# Altium project Pleiades_P01.PrjPcb (part 10 of 10)
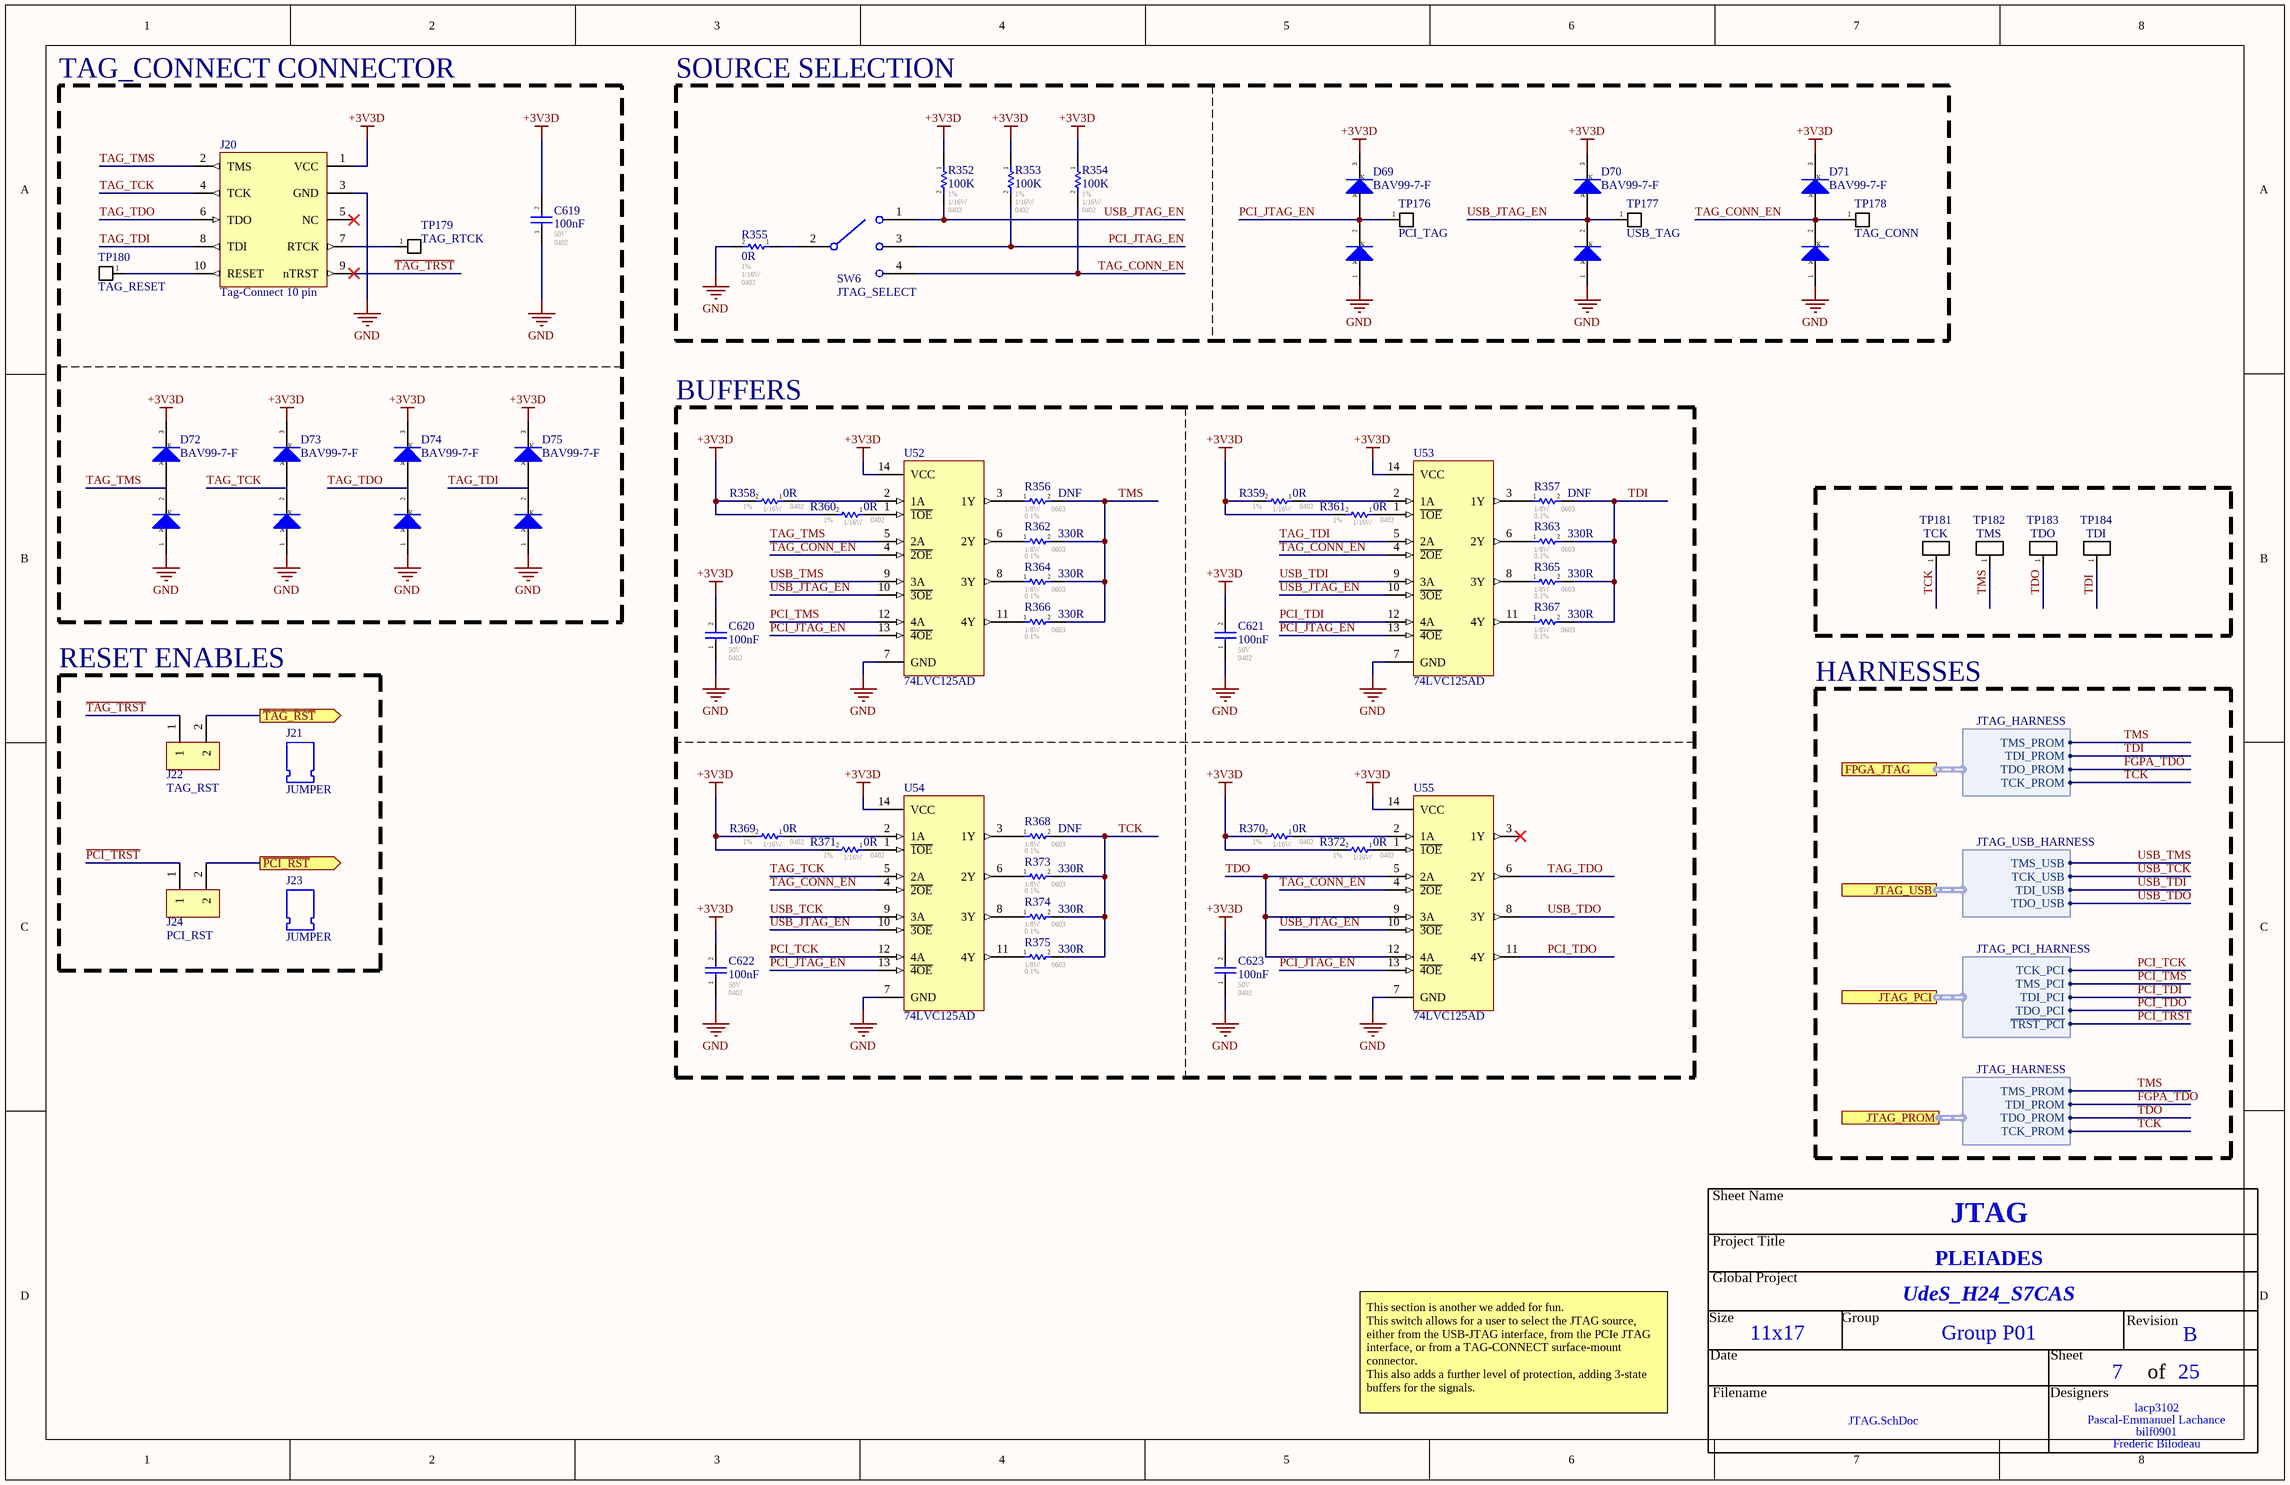
[diagram p65: JTAG.SchDoc]

## Nets that join several sheets
+1V2D: POWER_FPGA (9 pins), POWER_SENSING (Q7.1 R333.1 U40.17), FPGA_MISC (31 pins)
+1V8D: POWER_FPGA (8 pins), POWER_SENSING (Q6.1 R328.1 U40.21), PROM (10 pins), ADC (16 pins), DAC (18 pins), FPGA_MISC (5 pins), FPGA_IO (10 pins), SENSORS (5 pins)
+2V5D: POWER_DDR3 (16 pins), POWER_SENSING (R329.1 R330.1)
+3V3A: POWER_ANALOG (8 pins), ADC (12 pins), DAC (19 pins)
+3V3D: POWER_FPGA (13 pins), POWER_DDR3 (R222.1), POWER_MOTORS (C479.1 U32.1 U32.7), POWER_SENSING (11 pins), PROM (17 pins), FPGA_MISC (59 pins), FPGA_IO (42 pins), MOTOR_CONTROL (5 pins), USER_IO (36 pins), CLOCK (32 pins), USB (C487.1 C488.1 FB5.1), ETHERNET (6 pins), PCI (21 pins), SENSORS (18 pins), JTAG (28 pins)
+5V: POWER_INPUT (5 pins), MOTOR_CONTROL (C363.1 C367.1 U18.3 U18.4)
+5V0A: POWER_ANALOG (8 pins), ADC (18 pins), DAC (5 pins)
+5V_MOT: POWER_MOTORS (12 pins), MOTOR_CONTROL (18 pins)
+6V: POWER_ANALOG (15 pins), POWER_SENSING (R319.1 R320.1)
+12V: POWER_INPUT (10 pins), POWER_FPGA (C465.1 C466.1 R244.1 U29.1), POWER_DDR3 (C434.1 C435.1 U26.1), POWER_ANALOG (8 pins), POWER_SENSING (R315.1 R316.1 R326.1 R331.1), FPGA_MISC (C105.1 J2.2)
+24V_IN: POWER_INPUT (9 pins), POWER_MOTORS (R272.1 U36.1)
+24V_MOT: POWER_MOTORS (13 pins), MOTOR_CONTROL (8 pins)
+VDDR: DDR3 (83 pins), POWER_DDR3 (12 pins), POWER_SENSING (R321.1), FPGA_MISC (C143.1 C144.1 C145.1 C146.1), FPGA_IO (6 pins)
+VREF_DDR: POWER_DDR3 (C430.1 C431.1 TP87.1 U27.6), FPGA_IO (C149.1 U4.C3 U4.L8)
+VTT: DDR3 (59 pins), POWER_DDR3 (8 pins), POWER_SENSING (R322.1)
-5V0A: POWER_ANALOG (9 pins), ADC (18 pins), DAC (5 pins)
-6V: POWER_ANALOG (12 pins), POWER_SENSING (R318.2)
GND: MECHANICAL (19 pins), DDR3 (116 pins), POWER_INPUT (14 pins), POWER_FPGA (34 pins), POWER_DDR3 (51 pins), POWER_ANALOG (87 pins), POWER_MOTORS (C479.2 U32.2 U32.8), POWER_SENSING (39 pins), PROM (28 pins), ADC (80 pins), DAC (70 pins), FPGA_MISC (132 pins), FPGA_IO (5 pins), MOTOR_CONTROL (10 pins), USER_IO (47 pins), CLOCK (56 pins), USB (23 pins), ETHERNET (35 pins), PCI (44 pins), SENSORS (22 pins), JTAG (18 pins)
GND_IN: POWER_INPUT (9 pins), POWER_MOTORS (C486.1 R276.2 SW4.2 U36.3)
GND_MOT: POWER_MOTORS (23 pins), MOTOR_CONTROL (46 pins)
+1V2D_SHUNT_+: POWER_FPGA (NT51.2), POWER_SENSING (U41.12)
+1V2D_SHUNT_-: POWER_FPGA (NT50.2), POWER_SENSING (U41.13)
+1V8D_SHUNT_+: POWER_FPGA (NT49.2), POWER_SENSING (U41.10)
+1V8D_SHUNT_-: POWER_FPGA (NT48.2), POWER_SENSING (U41.9)
+2V5D_SHUNT_+: POWER_DDR3 (NT45.2), POWER_SENSING (U41.3)
+2V5D_SHUNT_-: POWER_DDR3 (NT44.2), POWER_SENSING (U41.2)
+3V3A_EN: POWER_ANALOG (R190.2), FPGA_IO (U4.A20)
+3V3D_SHUNT_+: POWER_FPGA (NT47.2), POWER_SENSING (U41.5)
+3V3D_SHUNT_-: POWER_FPGA (NT46.2), POWER_SENSING (U41.6)
+5V0A_EN: POWER_ANALOG (R189.2), FPGA_IO (U4.A21)
+6V_EN: POWER_ANALOG (R187.2 R197.1), FPGA_IO (U4.C21)
+6V_SHUNT_+: POWER_ANALOG (NT41.2), POWER_SENSING (U39.5)
+6V_SHUNT_-: POWER_ANALOG (NT40.2), POWER_SENSING (U39.6)
+12V_SHUNT_+: POWER_INPUT (NT39.2), POWER_SENSING (U39.3)
+12V_SHUNT_-: POWER_INPUT (NT38.2), POWER_SENSING (U39.2)
-5V0A_EN: POWER_ANALOG (R217.2 R219.1), FPGA_IO (U4.B22)
-6V_EN: POWER_ANALOG (R214.2 R215.1), FPGA_IO (U4.T20)
-6V_SHUNT_+: POWER_ANALOG (NT43.2), POWER_SENSING (U39.9)
-6V_SHUNT_-: POWER_ANALOG (NT42.2), POWER_SENSING (U39.10)
~{CAS}: DDR3 (NT8.2 U1.K3), FPGA_IO (U4.K6)
~{CE}: PROM (U6.B4), FPGA_IO (R63.2 U4.AF23)
~{CEO}: PROM (U6.D2), FPGA_IO (U4.AF18)
~{CF}: PROM (U6.D1), FPGA_IO (U4.AA17)
~{CS}: DAC (TP65.1 U11.33), FPGA_IO (U4.R3)
~{DDR_CS}: DDR3 (NT4.2 U1.L2), FPGA_IO (U4.K8)
~{DDR_RESET}: DDR3 (NT18.2 U1.T2), FPGA_IO (U4.B2)
~{ENABLE_ISO}: FPGA_IO (U4.V8), MOTOR_CONTROL (U13.3)
~{HOME_ISO}: FPGA_IO (U4.U9), MOTOR_CONTROL (ISO1.4)
~{IMU_CS}: FPGA_IO (U4.M6), SENSORS (TP170.1 U48.22)
~{IRQ}: DAC (U11.34), FPGA_IO (U4.N7)
~{PCI_RST}: FPGA_IO (R67.2), JTAG (J24.2)
~{PCI_TRST}: PCI (U44.14), JTAG (J24.1)
~{PERST_PCI}: FPGA_IO (U4.G8), PCI (TP142.1 U44.12)
~{PLL_SYNC}: FPGA_IO (U4.H17), CLOCK (TP15.1 U5.14)
~{PRSNT_PCI}: FPGA_IO (U4.F7), PCI (TP143.1 U44.11)
~{RAS}: DDR3 (NT6.2 U1.J3), FPGA_IO (U4.K7)
~{RESET_ISO}: FPGA_IO (U4.V10), MOTOR_CONTROL (U13.2)
~{RST_DAC}: DAC (R132.2 TP64.1 U11.36), FPGA_IO (U4.P7)
~{SENSE_CS}: POWER_SENSING (R312.2 U40.31), FPGA_IO (U4.B6)
~{SLEEP_ISO}: FPGA_IO (U4.T10), MOTOR_CONTROL (U17.3)
~{TAG_RST}: FPGA_IO (R68.2), JTAG (J22.2)
~{WAKE_PCI}: FPGA_IO (U4.C7), PCI (TP141.1 U44.13)
~{WDT_EN}: FPGA_MISC (R57.2 U3.3), FPGA_IO (U4.A25)
~{WE}: DDR3 (NT10.2 U1.L3), FPGA_IO (U4.E4)
ADC_CTRL1: ADC (TP44.1 U9.35), FPGA_IO (U4.T6)
ADC_CTRL2: ADC (TP45.1 U9.36), FPGA_IO (U4.T8)
ADC_CTRL3: ADC (TP46.1 U9.37), FPGA_IO (U4.M10)
ADC_SCLK: ADC (TP40.1 U9.13), FPGA_IO (U4.N8)
AUXIN: FPGA_IO (U4.W19), MOTOR_CONTROL (U18.9)
BTN_1: FPGA_IO (U4.Y15), USER_IO (6 pins)
BTN_2: FPGA_IO (U4.Y14), USER_IO (6 pins)
BUSY: PROM (R79.1 U6.C1), FPGA_IO (U4.Y16)
CK_N: DDR3 (NT27.2 U1.K7), FPGA_IO (U4.G3)
CK_P: DDR3 (NT24.2 U1.J7), FPGA_IO (U4.G4)
CKE: DDR3 (NT2.2 U1.K9), FPGA_IO (U4.F5)
CLK: PROM (U6.B3), FPGA_IO (R62.2 R64.1 U4.AD22)
CLK_ADC_400MHZ_N: ADC (C236.1 R94.1), CLOCK (U5.17)
CLK_ADC_400MHZ_P: ADC (C235.1 R95.1), CLOCK (U5.16)
CLK_ADC_OUT_N: ADC (TP39.1 U9.56), FPGA_IO (U4.A13)
CLK_ADC_OUT_P: ADC (TP37.1 U9.57), FPGA_IO (U4.C13)
CLK_DAC_200MHZ_N: DAC (R128.1 U11.4), CLOCK (U5.20)
CLK_DAC_200MHZ_P: DAC (R129.1 U11.3), CLOCK (U5.19)
CLK_FPGA_100MHZ_N: FPGA_IO (U4.B14), CLOCK (TP22.1 U5.28)
CLK_FPGA_100MHZ_P: FPGA_IO (U4.A14), CLOCK (TP21.1 U5.27)
CLKOUT: PROM (U6.C2), FPGA_IO (U4.AD18)
COL_CONFIG0: FPGA_IO (U4.R24), ETHERNET (U37.28)
CRS_CONFIG1: FPGA_IO (U4.N20), ETHERNET (U37.29)
D0_N: DAC (R151.1 U11.28), FPGA_IO (U4.F11)
D0_P: DAC (R148.1 U11.27), FPGA_IO (U4.D11)
D1_N: DAC (R144.1 U11.26), FPGA_IO (U4.E9)
D1_P: DAC (R141.1 U11.25), FPGA_IO (U4.F9)
D2_N: DAC (R138.1 U11.24), FPGA_IO (U4.A11)
D2_P: DAC (R135.1 U11.23), FPGA_IO (U4.C11)
D3_N: DAC (R150.1 U11.22), FPGA_IO (U4.C10)
D3_P: DAC (R147.1 U11.21), FPGA_IO (U4.D10)
D4_N: DAC (R143.1 U11.16), FPGA_IO (U4.C8)
D4_P: DAC (R140.1 U11.15), FPGA_IO (U4.D8)
D5_N: DAC (R137.1 U11.14), FPGA_IO (U4.A8)
D5_P: DAC (R134.1 U11.13), FPGA_IO (U4.B8)
D6_N: DAC (R149.1 U11.12), FPGA_IO (U4.A9)
D6_P: DAC (R146.1 U11.11), FPGA_IO (U4.C9)
D7_N: DAC (R142.1 U11.10), FPGA_IO (U4.A10)
D7_P: DAC (R139.1 U11.9), FPGA_IO (U4.B10)
DA0_N: ADC (U9.40), FPGA_IO (U4.C14)
DA0_P: ADC (U9.41), FPGA_IO (U4.D14)
DA2_N: ADC (U9.42), FPGA_IO (U4.A15)
DA2_P: ADC (U9.43), FPGA_IO (U4.C15)
DA4_N: ADC (U9.44), FPGA_IO (U4.A16)
DA4_P: ADC (U9.45), FPGA_IO (U4.B16)
DA6_N: ADC (U9.46), FPGA_IO (U4.G14)
DA6_P: ADC (U9.47), FPGA_IO (U4.J14)
DA8_N: ADC (U9.50), FPGA_IO (U4.H15)
DA8_P: ADC (U9.51), FPGA_IO (U4.J15)
DA10_N: ADC (U9.52), FPGA_IO (U4.C16)
DA10_P: ADC (U9.53), FPGA_IO (U4.D16)
DA12_N: ADC (U9.54), FPGA_IO (U4.F15)
DA12_P: ADC (U9.55), FPGA_IO (U4.G16)
DAC_SCLK: DAC (TP62.1 U11.32), FPGA_IO (U4.P6)
DB0_N: ADC (U9.60), FPGA_IO (U4.E16)
DB0_P: ADC (U9.61), FPGA_IO (U4.F16)
DB2_N: ADC (U9.62), FPGA_IO (U4.A17)
DB2_P: ADC (U9.63), FPGA_IO (U4.C17)
DB4_N: ADC (U9.2), FPGA_IO (U4.D19)
DB4_P: ADC (U9.3), FPGA_IO (U4.E19)
DB6_N: ADC (U9.4), FPGA_IO (U4.D20)
DB6_P: ADC (U9.5), FPGA_IO (U4.E20)
DB8_N: ADC (U9.6), FPGA_IO (U4.C20)
DB8_P: ADC (U9.7), FPGA_IO (U4.D21)
DB10_N: ADC (U9.8), FPGA_IO (U4.C18)
DB10_P: ADC (U9.9), FPGA_IO (U4.D18)
DB12_N: ADC (U9.10), FPGA_IO (U4.E17)
DB12_P: ADC (U9.11), FPGA_IO (U4.F17)
DCI_N: DAC (R136.1 U11.18), FPGA_IO (U4.D7)
DCI_P: DAC (R133.1 U11.17), FPGA_IO (U4.E8)
DDR_PWR_EN: POWER_DDR3 (R231.2), FPGA_IO (U4.AE26)
DDR_SW_EN: POWER_DDR3 (R223.2 R227.1), FPGA_IO (U4.AA25)
DDR_VTT_EN: POWER_DDR3 (R225.1), FPGA_IO (U4.AE25)
DEBUG_LED_1: FPGA_IO (U4.AF9), USER_IO (R172.1)
DEBUG_LED_2: FPGA_IO (U4.AD11), USER_IO (R173.1)
DEBUG_LED_3: FPGA_IO (U4.AE11), USER_IO (R183.1)
DEBUG_LED_4: FPGA_IO (U4.AF11), USER_IO (R184.1)
DIR_ISO: FPGA_IO (U4.U7), MOTOR_CONTROL (U16.2)
EN_EXT_SEL: PROM (R82.2 U6.H4), FPGA_IO (U4.AD19)
FAN_PWM: FPGA_MISC (D1.2 R54.1), FPGA_IO (U4.P18)
FAN_TACH: FPGA_MISC (D2.2 R55.1 R56.2), FPGA_IO (U4.R20)
FGPA_TDO: PROM (U6.G1), FPGA_IO (U4.A24)
FRAME_N: DAC (R131.1 U11.20), FPGA_IO (U4.C6)
FRAME_P: DAC (R130.1 U11.19), FPGA_IO (U4.D6)
HSI0_N: FPGA_IO (U4.D5), PCI (R334.2 U43.15)
HSI0_P: FPGA_IO (U4.E6), PCI (R334.1 U43.16)
HSO0_N: FPGA_IO (U4.A2), PCI (U43.13)
HSO0_P: FPGA_IO (U4.A3), PCI (U43.14)
IMU_FSYNC: FPGA_IO (U4.L7), SENSORS (TP171.1 U48.11)
IMU_INT: FPGA_IO (U4.L6), SENSORS (TP165.1 U48.12)
IMU_SCLK: FPGA_IO (U4.M8), SENSORS (TP167.1 U48.23)
IMU_SDI: FPGA_IO (U4.L4), SENSORS (TP168.1 U48.24)
IMU_SDO: FPGA_IO (U4.L3), SENSORS (TP169.1 U48.9)
IN0: FPGA_IO (U4.AF12), USER_IO (U19.3)
IN1: FPGA_IO (U4.AD12), USER_IO (U19.6)
IN2: FPGA_IO (U4.AD13), USER_IO (U19.8)
IN3: FPGA_IO (U4.AC13), USER_IO (U19.11)
INTRP: FPGA_IO (U4.M21), ETHERNET (R292.2 U37.21)
IO_IN_EN: FPGA_IO (U4.AA12), USER_IO (U19.1 U19.4 U19.10 U19.13)
IO_OUT_EN: FPGA_IO (U4.AC12), USER_IO (U20.1 U20.4 U20.10 U20.13)
LDM: DDR3 (NT16.2 U1.E7), FPGA_IO (U4.J3)
LDQS_N: DDR3 (U1.F3), FPGA_IO (U4.F1)
LDQS_P: DDR3 (U1.G3), FPGA_IO (U4.F3)
MDC: FPGA_IO (U4.R23), ETHERNET (U37.12)
MDIO: FPGA_IO (U4.AB24), ETHERNET (R291.2 U37.11)
MISO: ADC (TP43.1 U9.64), FPGA_IO (U4.R9)
MOSI: ADC (TP42.1 U9.14), FPGA_IO (U4.P8)
NetU4_T18: POWER_MOTORS (U32.4), FPGA_IO (U4.T18)
NetU4_T19: POWER_MOTORS (U32.5), FPGA_IO (U4.T19)
NetU4_U21: POWER_MOTORS (U32.6), FPGA_IO (U4.U21)
NetU4_U23: POWER_MOTORS (U32.3), FPGA_IO (U4.U23)
ODT: DDR3 (NT12.2 U1.K1), FPGA_IO (U4.H7)
OE/RESET: PROM (U6.A3), FPGA_IO (R65.2 U4.AE4)
OUT0: FPGA_IO (U4.AB13), USER_IO (U20.2)
OUT1: FPGA_IO (U4.AA13), USER_IO (U20.5)
OUT2: FPGA_IO (U4.Y13), USER_IO (U20.9)
OUT3: FPGA_IO (U4.W13), USER_IO (U20.12)
PCI_TCK: PCI (U42.14), JTAG (U54.12)
PCI_TDI: PCI (U42.12), JTAG (U53.12)
PCI_TDO: PCI (U42.11), JTAG (U55.11)
PCI_TMS: PCI (U42.13), JTAG (U52.12)
PLL_LOCK: FPGA_IO (U4.B20), CLOCK (TP20.1 U5.37)
PLL_SPI_CLK: FPGA_IO (U4.A18), CLOCK (TP17.1 U5.24)
PLL_SPI_LE: FPGA_IO (U4.B18), CLOCK (TP16.1 U5.25)
PLL_SPI_MISO: FPGA_IO (U4.A19), CLOCK (TP19.1 U5.22)
PLL_SPI_MOSI: FPGA_IO (U4.C19), CLOCK (TP18.1 U5.23)
PROGRAM_B: FPGA_IO (R66.2 R67.1 R68.1 U4.AF3), USB (R277.2 R285.1)
PROM_D0: PROM (U6.H6), FPGA_IO (U4.AD20)
PROM_D1: PROM (U6.H5), FPGA_IO (U4.AE17)
PROM_D2: PROM (U6.E5), FPGA_IO (U4.AF17)
PROM_D3: PROM (U6.D5), FPGA_IO (U4.AD10)
PROM_D4: PROM (U6.C5), FPGA_IO (U4.AF10)
PROM_D5: PROM (U6.B5), FPGA_IO (U4.AE7)
PROM_D6: PROM (U6.A5), FPGA_IO (U4.AF7)
PROM_D7: PROM (U6.A6), FPGA_IO (U4.AE9)
PROM_TCK: PROM (U6.H3), FPGA_IO (U4.E21), JTAG (5 pins)
PROM_TDO: PROM (U6.E6), JTAG (TP183.1 U55.5 U55.9 U55.12)
PROM_TMS: PROM (U6.E2), FPGA_IO (U4.C23), JTAG (5 pins)
REF_CLK_N: DAC (TP67.1 U11.7), FPGA_IO (U4.R1)
REF_CLK_P: DAC (TP66.1 U11.6), FPGA_IO (U4.R2)
REFCLK_N: FPGA_IO (U4.A4), PCI (U45.13)
REFCLK_P: FPGA_IO (U4.B4), PCI (U45.14)
RESET: ADC (TP38.1 U9.12), FPGA_IO (U4.P10)
REV_SEL0: PROM (R80.1 U6.G3), FPGA_IO (U4.W17)
REV_SEL1: PROM (R81.1 U6.G4), FPGA_IO (U4.V16)
RFUSE: FPGA_MISC (J1.2 TP4.1), FPGA_IO (U4.AA20)
RST_ETH_PHY: FPGA_IO (U4.N19), ETHERNET (D46.2)
RTC_MFP: FPGA_MISC (R45.2 TP5.1 U2.7), FPGA_IO (U4.L24)
RTC_SCL: FPGA_MISC (R47.2 TP7.1 U2.6), FPGA_IO (U4.K19)
RTC_SDA: FPGA_MISC (R46.2 TP6.1 U2.5), FPGA_IO (U4.L19)
RXC: FPGA_IO (U4.W25), ETHERNET (R301.2)
RXD: FPGA_IO (U4.W18), MOTOR_CONTROL (U18.5)
RXD0: FPGA_IO (U4.V23), ETHERNET (R297.2)
RXD1: FPGA_IO (U4.W24), ETHERNET (R298.2)
RXD2: FPGA_IO (U4.U25), ETHERNET (R299.2)
RXD3: FPGA_IO (U4.U26), ETHERNET (R300.2)
RXDV: FPGA_IO (U4.P21), ETHERNET (R294.2)
RXER: FPGA_IO (U4.P22), ETHERNET (R295.2)
SCL1: FPGA_IO (U4.AA11), SENSORS (R346.2 TP164.1 U47.4)
SCL2: FPGA_IO (U4.R25), SENSORS (R348.2 TP172.1 U49.4)
SCL3: FPGA_IO (U4.AC16), SENSORS (R350.2 TP174.1 U50.4)
SD_CLK: FPGA_IO (U4.R19), USER_IO (J15.5 R181.2)
SD_CMD: FPGA_IO (U4.R17), USER_IO (J15.3 R180.2)
SD_D0: FPGA_IO (U4.U24), USER_IO (J15.7 R176.2)
SD_D1: FPGA_IO (U4.R22), USER_IO (J15.8 R177.2)
SD_D2: FPGA_IO (U4.R21), USER_IO (J15.1 R178.2)
SD_D3: FPGA_IO (U4.P17), USER_IO (J15.2 R179.2)
SD_DET: FPGA_IO (U4.R18), USER_IO (J15.DL J15.DS R175.2)
SDA1: FPGA_IO (U4.AB11), SENSORS (R345.2 TP163.1 U47.5)
SDA2: FPGA_IO (U4.R26), SENSORS (R347.2 TP166.1 U49.5)
SDA3: FPGA_IO (U4.AD17), SENSORS (R349.2 TP173.1 U50.5)
SDIO: DAC (TP63.1 U11.31), FPGA_IO (U4.R4)
SEN: ADC (TP41.1 U9.15), FPGA_IO (U4.R7)
SENSE_MISO: POWER_SENSING (U40.34), FPGA_IO (U4.A7)
SENSE_MOSI: POWER_SENSING (U40.33), FPGA_IO (U4.A6)
SENSE_SCLK: POWER_SENSING (U40.32), FPGA_IO (U4.A5)
SERIAL_NO: FPGA_IO (U4.P26), SENSORS (R351.2 TP175.1 U51.1)
SILENT: FPGA_IO (U4.AB21), MOTOR_CONTROL (U18.6)
SMCLK_PCI: FPGA_IO (U4.E10), PCI (TP144.1 U46.2)
SMDAT_PCI: FPGA_IO (U4.F10), PCI (TP145.1 U46.3)
SR_ISO: FPGA_IO (U4.U5), MOTOR_CONTROL (U16.3)
STBY: FPGA_IO (U4.AB22), MOTOR_CONTROL (U18.8)
STEP_ISO: FPGA_IO (U4.W10), MOTOR_CONTROL (U17.2)
SUSPEND: FPGA_MISC (R52.2 TP8.1), FPGA_IO (U4.AD23)
TCK_USB: USB (M1.10), JTAG (U54.9)
TDI: FPGA_IO (U4.F20), JTAG (5 pins)
TDI_USB: USB (M1.12), JTAG (U53.9)
TDO_USB: USB (M1.11), JTAG (U55.8)
TMS_USB: USB (M1.13), JTAG (U52.9)
TXC: FPGA_IO (U4.W26), ETHERNET (U37.22)
TXD: FPGA_IO (U4.AF25), MOTOR_CONTROL (U18.7)
TXD0: FPGA_IO (U4.T24), ETHERNET (U37.24)
TXD1: FPGA_IO (U4.T26), ETHERNET (U37.25)
TXD2: FPGA_IO (U4.Y24), ETHERNET (U37.26)
TXD3: FPGA_IO (U4.Y26), ETHERNET (U37.27)
TXEN: FPGA_IO (U4.V24), ETHERNET (U37.23)
TXENABLE: DAC (U11.30), FPGA_IO (U4.N6)
TXER: FPGA_IO (U4.V26), ETHERNET (U37.31)
UDM: DDR3 (NT14.2 U1.D3), FPGA_IO (U4.J4)
UDQS_N: DDR3 (U1.C7), FPGA_IO (U4.L1)
UDQS_P: DDR3 (U1.B7), FPGA_IO (U4.L2)
USB_CTS: FPGA_IO (U4.G20), USB (M1.3)
USB_RTS: FPGA_IO (U4.G21), USB (M1.4)
USB_RX: FPGA_IO (U4.A23), USB (M1.5)
USB_TX: FPGA_IO (U4.B23), USB (M1.6)
USM0_ISO: FPGA_IO (U4.U8), MOTOR_CONTROL (U15.2)
USM1_ISO: FPGA_IO (U4.Y5), MOTOR_CONTROL (U15.3)
VBATT: FPGA_MISC (C101.1 R48.1 R51.1 TP9.1), FPGA_IO (U4.W21)
VFS: FPGA_MISC (C102.1 R49.1 TP10.1), FPGA_IO (U4.AB19)
VTT_PG: POWER_DDR3 (R222.2 U27.9), FPGA_IO (U4.AA26)
WDT_IN: FPGA_MISC (U3.4), FPGA_IO (U4.B24)
WDTO: FPGA_MISC (J4.2), FPGA_IO (R66.1 U4.C25)

## Assembly variants
PLEIADES: all parts fitted